# EAGLE schematic voltage_regulator (EAGLE 9.6.2)
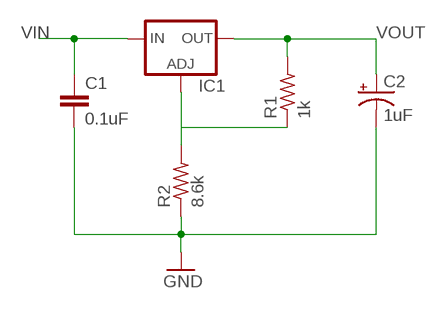
[diagram p0: schematic, sheet 1]

## Parts
C1  0.1uF  C2,5-3  [C2.5-3]
C2  1uF  CPOL-US153CLV-0810  [153CLV-0810]
IC1  LM317TL  [317TL]
R1  1k  R-US_0204/7  [0204/7]
R2  8.6k  R-US_0204/7  [0204/7]

## Nets
GND: C1.2 C2.- R2.1
N$1: IC1.1(ADJ) R1.1 R2.2
VIN: C1.1 IC1.3(IN)
VOUT: C2.+ IC1.2(OUT) R1.2

## Library data of the parts
C1 = capacitor-wima:C: CAPACITOR naming: grid - package width
C2 = rcl:CPOL-US: POLARIZED CAPACITOR, American symbol; SPICEPREFIX: C
IC1 = v-reg:LM317TL: VOLTAGE REGULATOR
R1 R2 = rcl:R-US_: RESISTOR, American symbol; SPICEPREFIX: R